# Altium schematic sheet DXL Bus.SchDoc
size A4; DrawnBy: Eko Rudiawan
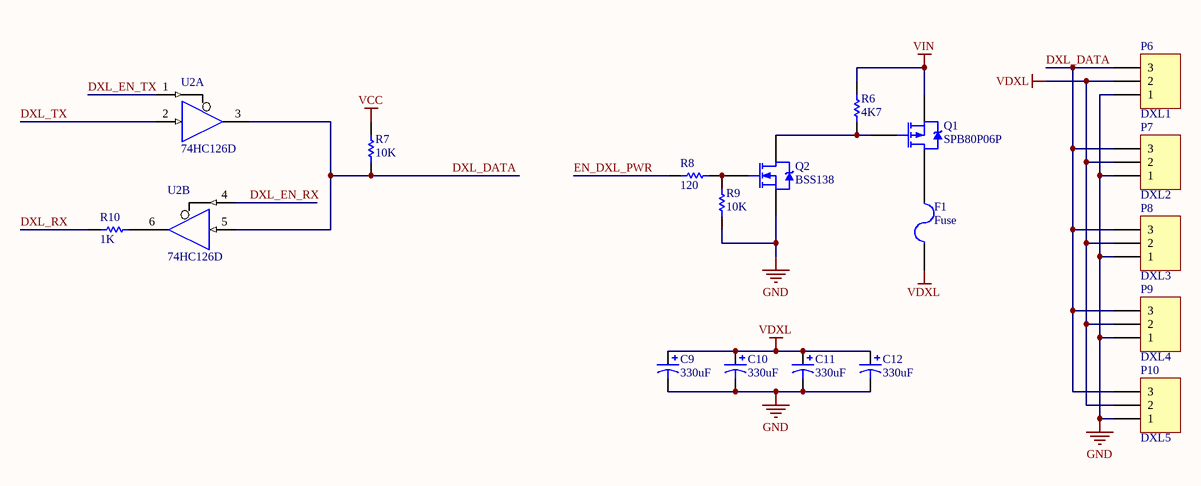
[diagram p0: DXL Bus.SchDoc]

## Parts
C9  330uF  [SV-C]
C10  330uF  [SV-C]
C11  330uF  [SV-C]
C12  330uF  [SV-C]
F1  Fuse  [FUSE-HOLDER-SMD]
P6  DXL1  [DXL]
P7  DXL2  [DXL]
P8  DXL3  [DXL]
P9  DXL4  [DXL]
P10  DXL5  [DXL]
Q1  SPB80P06P  [TO263]
Q2  BSS138  [SOT23]
R6  4K7  [0603-RES]
R7  10K  [0603-RES]
R8  120  [0603-RES]
R9  10K  [0603-RES]
R10  1K  [0603-RES]
U2  74HC126D  [14-SOIC]  (parts A,B of 4)

## Nets
GND: C9.2 C10.2 C11.2 C12.2 P6.1 P7.1 P8.1 P9.1 P10.1 Q2.2(S) R9.1 U2.7(GND)
VCC: R7.2 U2.14(VCC)
VDXL: C9.1 C10.1 C11.1 C12.1 F1.1 P6.2 P7.2 P8.2 P9.2 P10.2
VIN: Q1.3(S) R6.2
DXL_DATA: P6.3 P7.3 P8.3 P9.3 P10.3 R7.1 U2.3(Y) U2.5(A)
DXL_EN_RX: U2.4(OE)
DXL_EN_TX: U2.1(OE)
DXL_RX: R10.1
DXL_TX: U2.2(A)
EN_DXL_PWR: R8.1
NetF1_2: F1.2 Q1.2(D)
NetQ1_1: Q1.1(G) Q2.3(D) R6.1
NetQ2_1: Q2.1(G) R8.2 R9.2
NetR10_2: R10.2 U2.6(Y)

## Library data of the parts
C9-C12 = Cap Pol: Polarized Capacitor (Axial); Published: 8-Jun-2000; LatestRevisionDate: 17-Jul-2002; LatestRevisionNote: Re-released for DXP Platform.; PackageReference: POLAR0.8; Publisher: Altium Limited; PackageDescription: Polarized Capacitor; 2 Leads; Value: 330uF
P6-P10 = Header 3: Header, 3-Pin; LatestRevisionDate: 17-Jul-2002; LatestRevisionNote: Re-released for DXP Platform.; Publisher: Altium Limited
Q1 = PMOS: P-Channel Power MOSFET; Note: Pin 4 not drawn and electrically connected to Pin 2.; Published: 8-Jun-2000; LatestRevisionDate: 17-Jul-2002; LatestRevisionNote: Re-released for DXP Platform.; DatasheetVersion: PD-9.390D; PackageVersion: Feb-1997; PackageReference: TO-220AB; Publisher: Altium Limited; PackageDescription: TO, Thru-Hole, Vertical, Heatsink Mounted; 3 In-Line Leads; Pitch 2.54 mm; ComponentLink1Description: Manufacturer Link; ComponentLink1URL: http://www.irf.com/
Q2 = NMOS: N-Channel Power MOSFET; Note: Pin 2 is electrically connected to pin 4.; Published: 8-Jun-2000; LatestRevisionDate: 17-Jul-2002; LatestRevisionNote: Re-released for DXP Platform.; DatasheetVersion: PD-9.814; PackageVersion: Feb-1997; PackageReference: TO-220AB; Publisher: Altium Limited; PackageDescription: TO, Thru-Hole, Vertical, Heatsink Mounted; 3 In-Line Leads; Pitch 2.54 mm; ComponentLink1Description: Manufacturer Link; ComponentLink1URL: http://www.irf.com/
R6-R10 = Res: Resistor; Published: 8-Jun-2000; LatestRevisionDate: 17-Jul-2002; LatestRevisionNote: Re-released for DXP Platform.; PackageReference: AXIAL-0.3; Publisher: Altium Limited; PackageDescription: Axial Device, Thru-Hole; 2 Leads; 0.3 in Pin Spacing
  R6: Value: 4K7
  R7 R9: Value: 10K
  R8: Value: 120
  R10: Value: 1K
U2 = 74HC126D: Quadruple Bus Buffer Gate with 3-State Outputs; Published: 8-Jun-2000; LatestRevisionDate: 13-Apr-2006; LatestRevisionNote: IPC-7351 Footprint Added.; DatasheetVersion: Oct-1998; PackageVersion: Jan-1998; PackageReference: D014; Publisher: Altium Limited; PackageDescription: 14-Pin Small Outline Integrated Circuit 1.27 mm Pitch; Code_IPC: SOIC127P600-14; ComponentLink1Description: Manufacturer Link; ComponentLink1URL: http://www.ti.com/; ComponentLink2Description: Datasheet; ComponentLink2URL: http://www-s.ti.com/sc/ds/sn74ahct126.pdf
F1 = Fuse: Published: 8-Jun-2000; LatestRevisionDate: 17-Jul-2002; LatestRevisionNote: Re-released for DXP Platform.; PackageReference: PIN-W2/E2.8; Publisher: Altium Limited; PackageDescription: Thru-Hole; 2 Leads